# EasyEDA schematic SCH_Dual Power Supply_2023-09-18.json
TITLE: Sheet_1; REV: 1.0; Date: 2021-09-18; Sheet: 1/1; Drawn By: joshua.ifeanyi.okonkwo; Company: Your Company
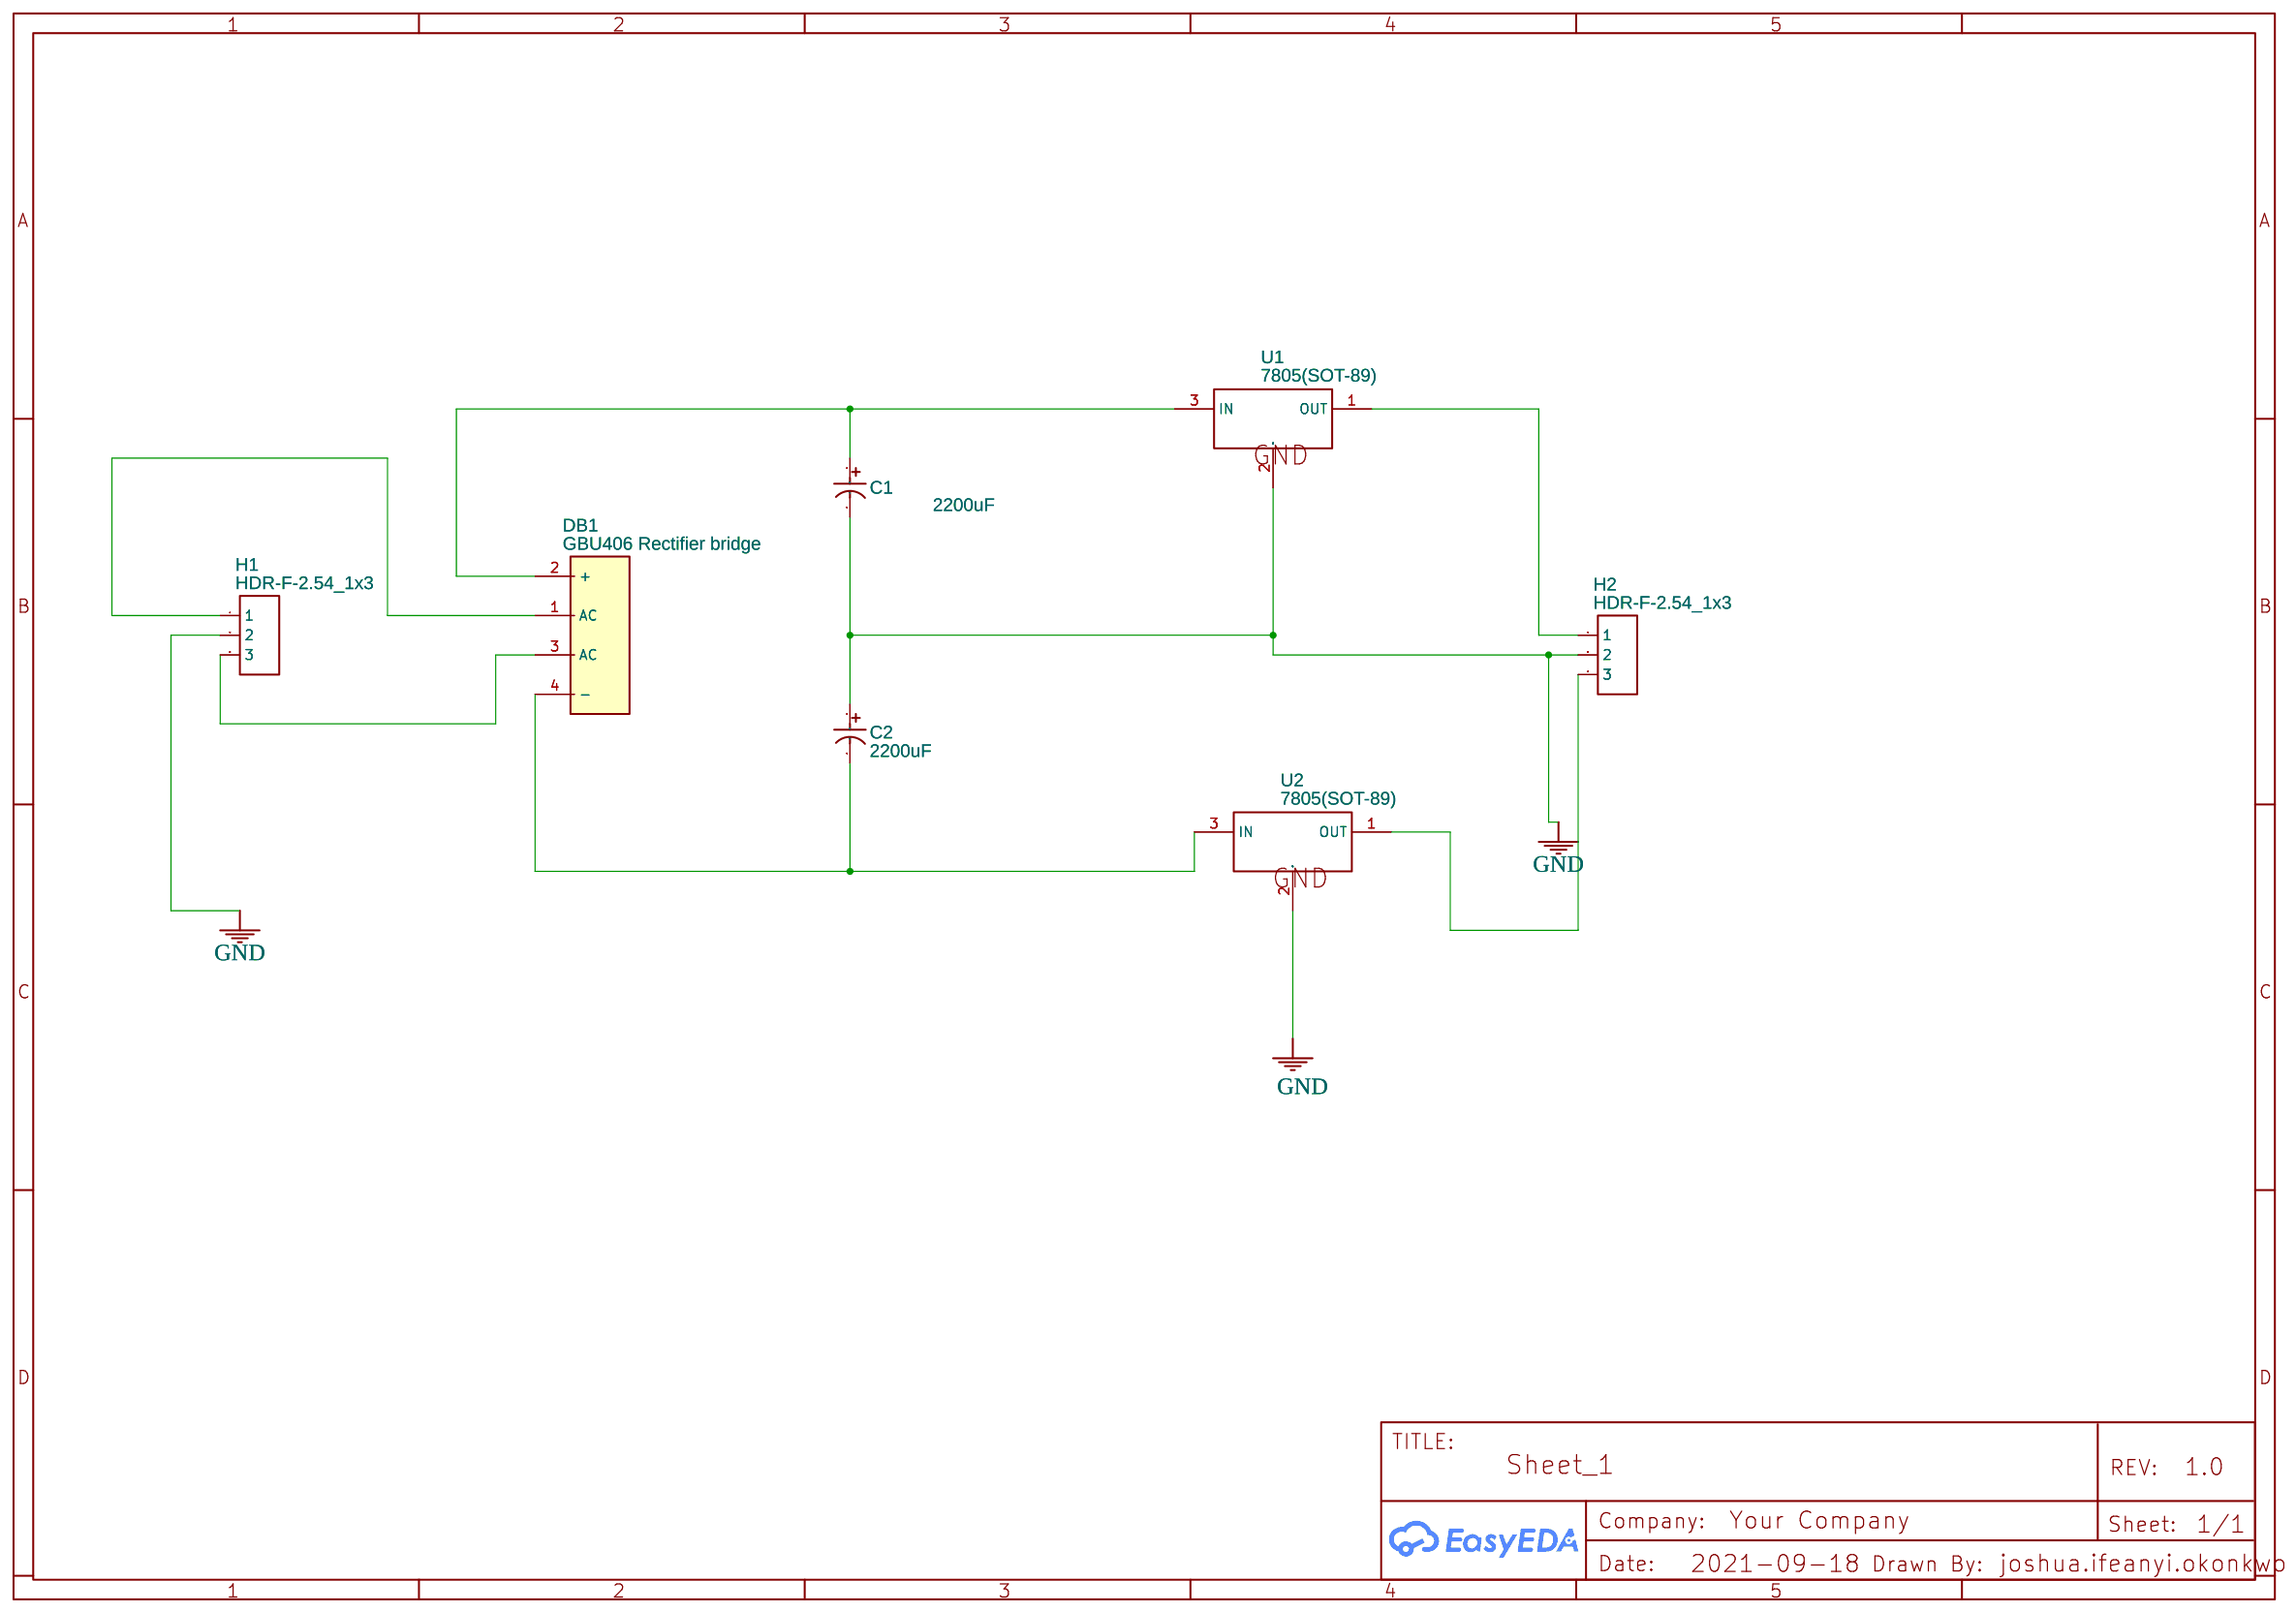
[diagram p0: schematic sheet]

## Parts
C1  2200uF  [CAP-TH_BD13.0-P5.00-D1.2-FD]
C2  2200uF  [CAP-TH_BD13.0-P5.00-D1.2-FD]
DB1  GBU406 Rectifier bridge  [DIO-BG-TH_GBU406]
H1  HDR-F-2.54_1x3  [HDR-F-2.54_1X3]
H2  HDR-F-2.54_1x3  [HDR-F-2.54_1X3]
U1  7805(SOT-89)  [SOT-89-3_L4.5-W2.5-P1.50-LS4.2-BR]
U2  7805(SOT-89)  [SOT-89-3_L4.5-W2.5-P1.50-LS4.2-BR]

## Library data of the parts
C1 C2 = 2200uF 25V 13*20: Supplier: LCSC; Manufacturer: CX(承兴); Manufacturer Part: KM228M025J20RR0VH2FP0; Supplier Part: C44598; JLCPCB Part Class: Extended Part; link: https://lcsc.com/eda_search?q=C44598&%26type=1&ref=editor
DB1 = GBU406 Rectifier bridge: Supplier: LCSC; Manufacturer: MDD; Manufacturer Part: GBU406; Supplier Part: C13432; JLCPCB Part Class: Extended Part; link: https://lcsc.com/eda_search?q=C13432&%26type=1&ref=editor
H1 H2 = HDR-F-2.54_1x3: Supplier Part: C146690; Supplier: LCSC; Contributor: LCEDA_Lib
U1 U2 = 7805(SOT-89): Supplier: LCSC; Manufacturer: CJ; Manufacturer Part: CJ78L05; image: //image.lceda.cn/szlcsc/C2079.jpg; Supplier Part: C2079; Paste Type: expand; Contributor: LCEDA_Lib

## Nets
GND: C1.2 C2.1 H1.2 H2.2 U1.2(GND) U2.2(GND)
Net-(C1-1): C1.1 DB1.2(+) U1.3(IN)
Net-(C2-2): C2.2 DB1.4(-) U2.3(IN)
Net-(DB1-1): DB1.1(AC) H1.1
Net-(DB1-3): DB1.3(AC) H1.3
Net-(H2-1): H2.1 U1.1(OUT)
Net-(H2-3): H2.3 U2.1(OUT)
